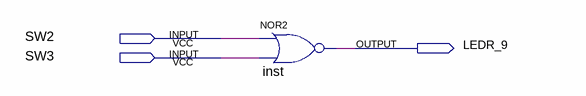
[diagram p0: schematic sheet]
// Quartus schematic Block2.bdf as structural Verilog: 1 symbols, 3 pins
module Block2 (
  input  SW2,
  input  SW3,
  output LEDR_9
);

  nor inst (LEDR_9, SW2, SW3);
endmodule
